# Altium schematic sheet so do mach.SchDoc
size A2
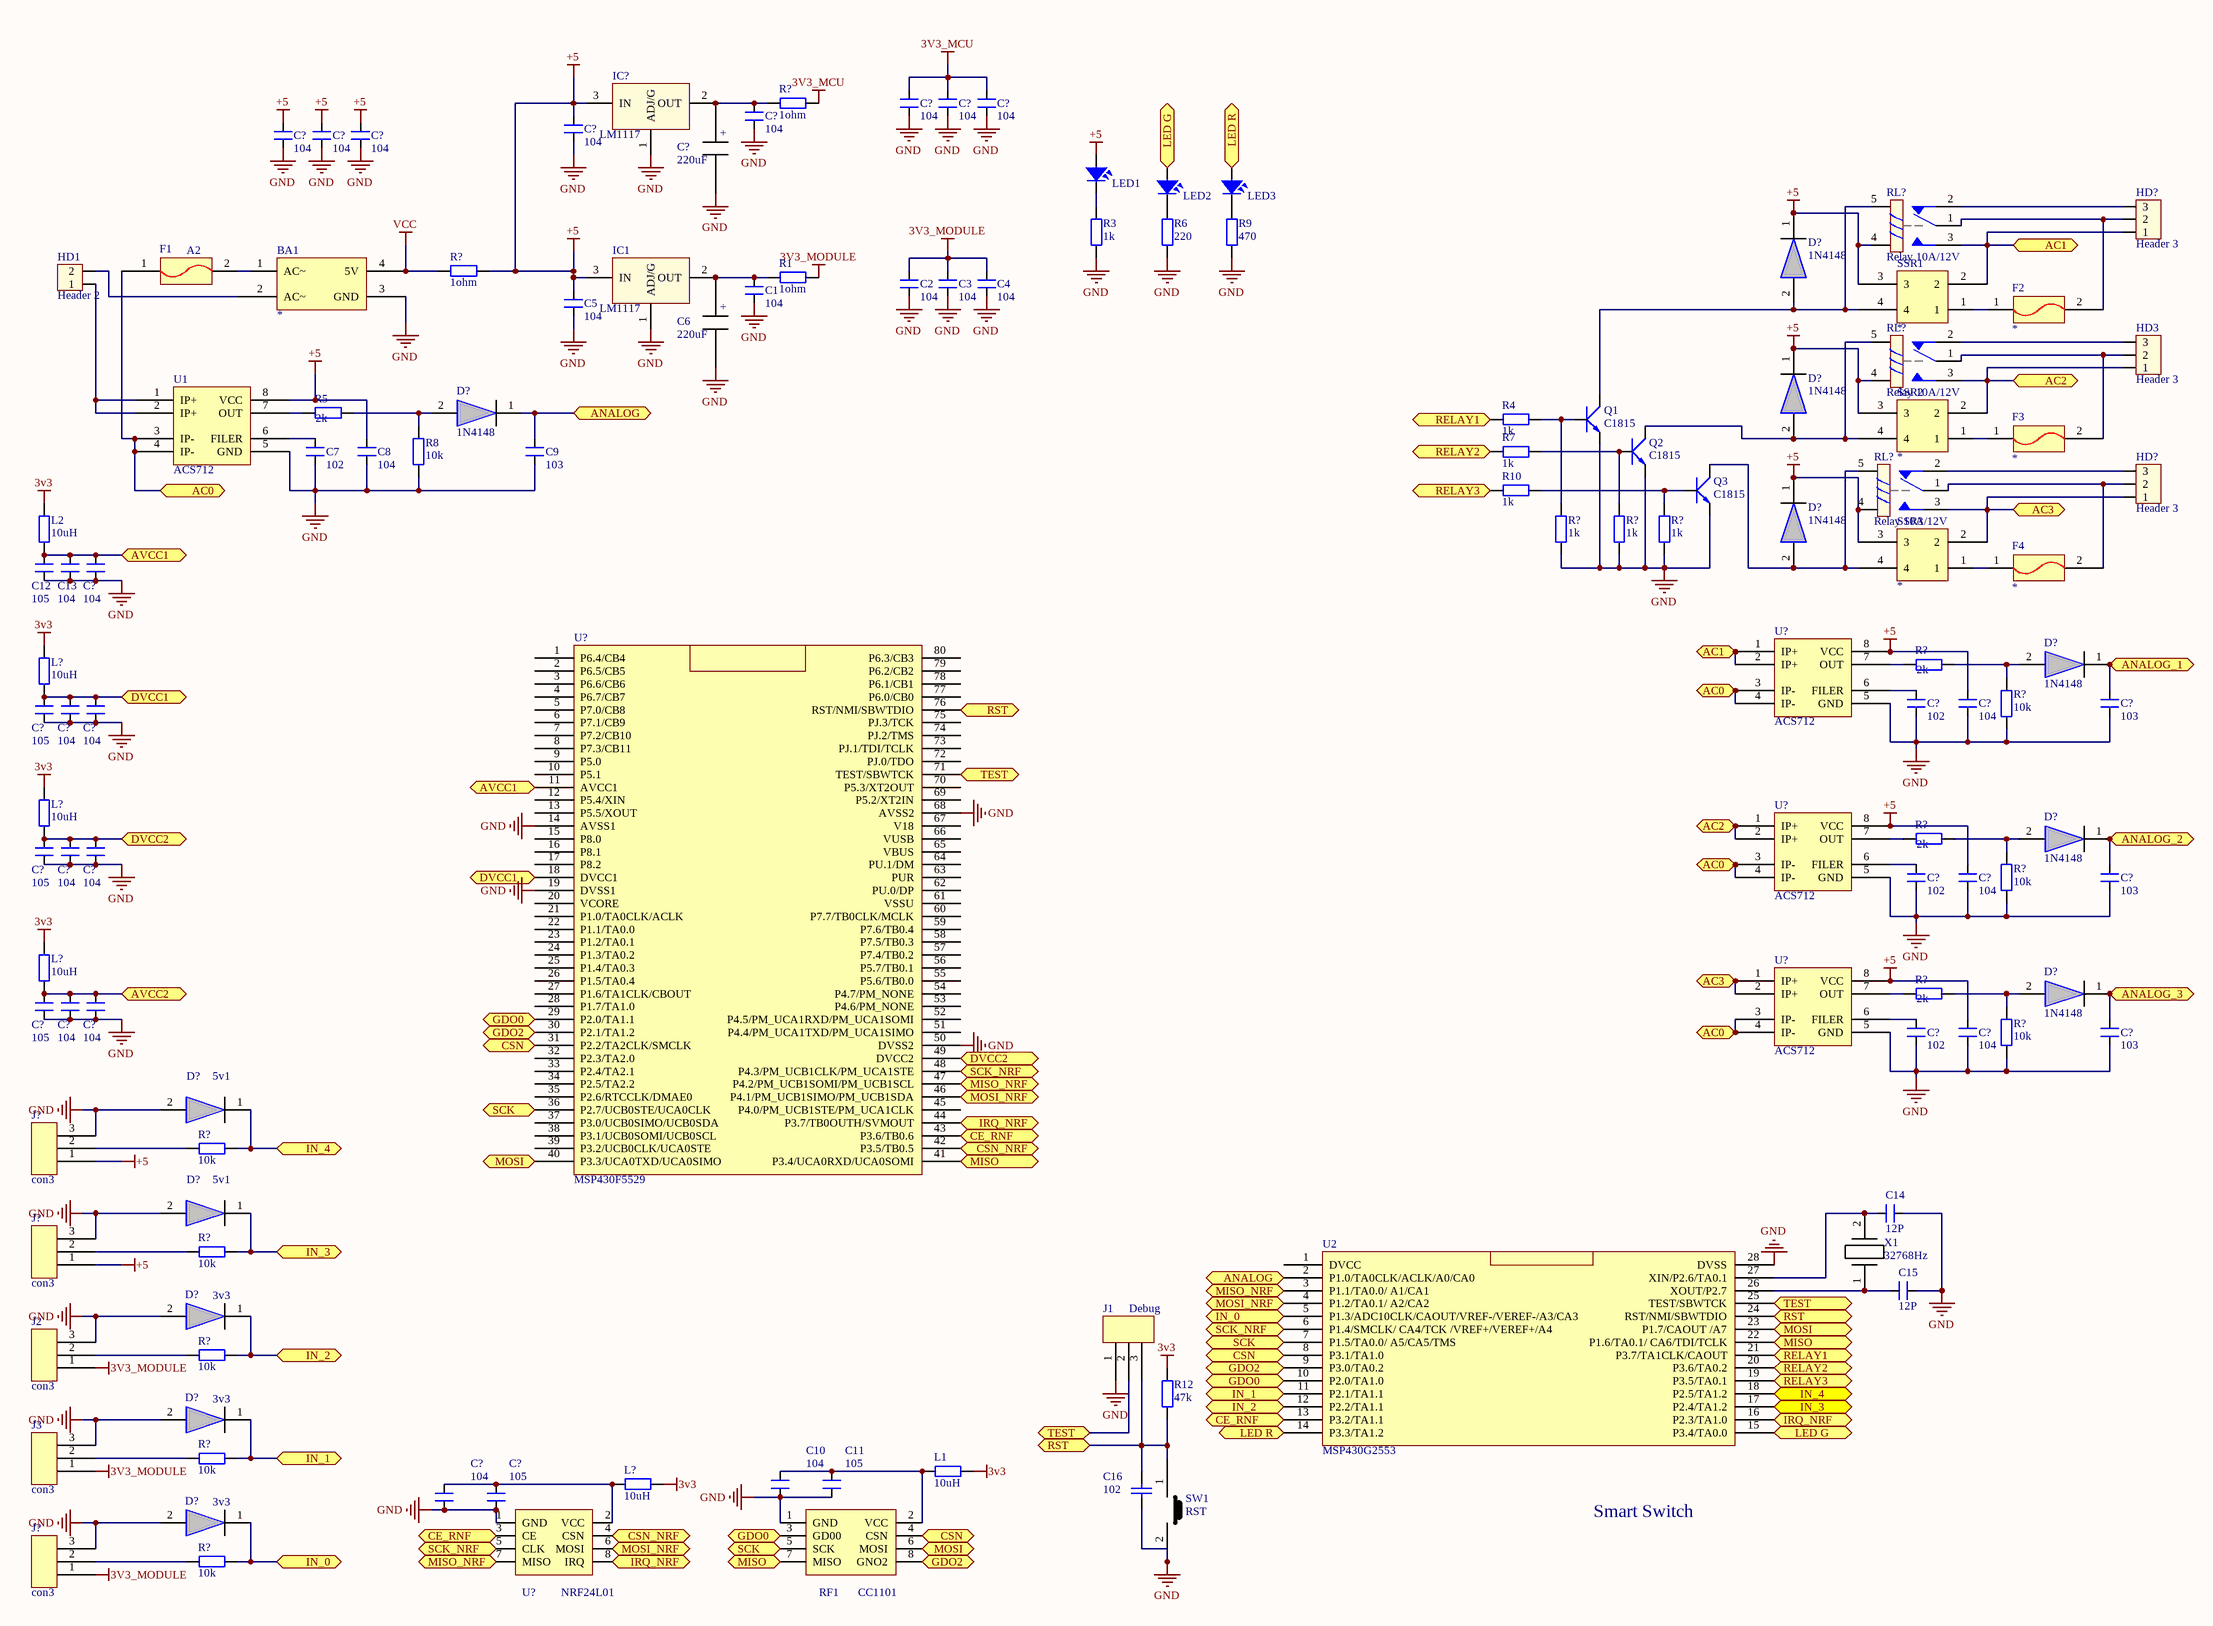
[diagram p0: so do mach.SchDoc]

## Parts
(Parts that share a designator on the sheet are numbered #1, #2 ... from top to bottom, then left to right.)
BA1  *  [bien ap 5V-700ma]
C1  104  [CM-0805]
C2  104  [CM-0805]
C3  104  [CM-0805]
C4  104  [CM-0805]
C5  104  [CM-0805]
C6  220uF  [CAPAE7053X54M]
C7  102  [CM-0805]
C8  104  [CM-0805]
C9  103  [CM-0805]
C10  104  [CM-0805]
C11  105  [CM-0805]
C12  105  [CM-0805]
C13  104  [CM-0805]
C14  12P  [CM-0805]
C15  12P  [CM-0805]
C16  value 102  [C0805]  (hidden comment: Capacitor Ceramic)
C?#1  104  [CM-0805]
C?#2  104  [CM-0805]
C?#3  104  [CM-0805]
C?#4  104  [CM-0805]
C?#5  104  [CM-0805]
C?#6  104  [CM-0805]
C?#7  104  [CM-0805]
C?#8  104  [CM-0805]
C?#9  220uF  [CAPAE7053X54M]
C?#10  104  [CM-0805]
C?#11  102  [CM-0805]
C?#12  104  [CM-0805]
C?#13  103  [CM-0805]
C?#14  105  [CM-0805]
C?#15  104  [CM-0805]
C?#16  104  [CM-0805]
C?#17  105  [CM-0805]
C?#18  104  [CM-0805]
C?#19  104  [CM-0805]
C?#20  102  [CM-0805]
C?#21  104  [CM-0805]
C?#22  103  [CM-0805]
C?#23  105  [CM-0805]
C?#24  104  [CM-0805]
C?#25  104  [CM-0805]
C?#26  102  [CM-0805]
C?#27  104  [CM-0805]
C?#28  103  [CM-0805]
C?#29  104  [CM-0805]
C?#30  105  [CM-0805]
D?#1  1N4148  [DIOMELF3615N]
D?#2  1N4148  [DIOMELF3615N]
D?#3  1N4148  [DIOMELF3615N]
D?#4  1N4148  [DIOMELF3615N]
D?#5  1N4148  [DIOMELF3615N]
D?#6  1N4148  [DIOMELF3615N]
D?#7  1N4148  [DIOMELF3615N]
D?#8  5v1  [DIOMELF3615N]
D?#9  5v1  [DIOMELF3615N]
D?#10  3v3  [DIOMELF3615N]
D?#11  3v3  [DIOMELF3615N]
D?#12  3v3  [DIOMELF3615N]
F1  A2  [Fuse 2A - duplicate]
F2  *  [Fuse 2A - duplicate]
F3  *  [Fuse 2A - duplicate]
F4  *  [Fuse 2A - duplicate]
HD1  Header 2  [HED2]
HD3  Header 3  [HED3]
HD?#1  Header 3  [HED3]
HD?#2  Header 3  [HED3]
IC1  LM1117  [SOT223-4N]
IC?  LM1117  [SOT223-4N]
J1  Debug  [Con3]
J2  con3  [Con3]
J3  con3  [Con3]
J?#1  con3  [Con3]
J?#2  con3  [Con3]
J?#3  con3  [Con3]
L1  10uH  [SM-RES-0805]
L2  10uH  [SM-RES-0805]
L?#1  10uH  [SM-RES-0805]
L?#2  10uH  [SM-RES-0805]
L?#3  10uH  [SM-RES-0805]
L?#4  10uH  [SM-RES-0805]
LED1  LED  [LED-3]  (value not drawn)
LED2  LED  [LED-3]  (value not drawn)
LED3  LED  [LED-3]  (value not drawn)
Q1  C1815  [SOT23B]
Q2  C1815  [SOT23B]
Q3  C1815  [SOT23B]
R1  1ohm  [SM-RES-0805]
R3  1k  [SM-RES-0805]
R4  1k  [SM-RES-0805]
R5  2k  [SM-RES-0805]
R6  220  [SM-RES-0805]
R7  1k  [SM-RES-0805]
R8  10k  [SM-RES-0805]
R9  470  [SM-RES-0805]
R10  1k  [SM-RES-0805]
R12  47k  [SM-RES-0805]
R?#1  1ohm  [SM-RES-0805]
R?#2  1ohm  [SM-RES-0805]
R?#3  1k  [SM-RES-0805]
R?#4  1k  [SM-RES-0805]
R?#5  1k  [SM-RES-0805]
R?#6  2k  [SM-RES-0805]
R?#7  10k  [SM-RES-0805]
R?#8  2k  [SM-RES-0805]
R?#9  10k  [SM-RES-0805]
R?#10  2k  [SM-RES-0805]
R?#11  10k  [SM-RES-0805]
R?#12  10k  [SM-RES-0805]
R?#13  10k  [SM-RES-0805]
R?#14  10k  [SM-RES-0805]
R?#15  10k  [SM-RES-0805]
R?#16  10k  [SM-RES-0805]
RF1  CC1101  [CC1101 - duplicate1]
RL?#1  Relay 10A/12V  [RL_SPDT_10A]
RL?#2  Relay 10A/12V  [RL_SPDT_10A]
RL?#3  Relay 10A/12V  [RL_SPDT_10A]
SSR1  *  [OMRON g3mb]
SSR2  *  [OMRON g3mb]
SSR3  *  [OMRON g3mb]
SW1  RST  [BUTTON]
U1  ACS712  [SOIC127P600X265-8N]
U2  MSP430G2553  [TSOP65P640X120-28N]
U?#1  ACS712  [SOIC127P600X265-8N]
U?#2  ACS712  [SOIC127P600X265-8N]
U?#3  MSP430F5529  [SQFP50P1400X1400X245-80N]
U?#4  ACS712  [SOIC127P600X265-8N]
U?#5  NRF24L01  [NRF24L01]
X1  32768Hz  [32768hz]

## Ports
AC0, AC1, AC2, AC3, ANALOG, ANALOG_1, ANALOG_2, ANALOG_3, AVCC1, AVCC2, CE_RNF, CSN, CSN_NRF, DVCC1, DVCC2, GDO0, GDO2, IN_0, IN_1, IN_2, IN_3, IN_4, IRQ_NRF, LED G, LED R, MISO, MISO_NRF, MOSI, MOSI_NRF, RELAY1, RELAY2, RELAY3, RST, SCK, SCK_NRF, TEST

## Nets
3v3: L1.2 L2.2 L?#1.2 L?#2.2 L?#3.2 L?#4.2 R12.1
3V3_MCU: C?#1.2 C?#2.2 C?#3.2 R?#1.1
3V3_MODULE: C2.2 C3.2 C4.2 J2.1 J3.1 J?#3.1 R1.1
+5: C5.2 C8.2 C?#5.2 C?#6.2 C?#7.2 C?#8.2 C?#12.2 C?#21.2 C?#27.2 D?#1.1 D?#2.1 D?#4.1 IC1.3(IN) IC?.3(IN) J?#1.1 J?#2.1 LED1.1 R?#2.1 RL?#1.4 RL?#2.4 RL?#3.4 SSR1.3 SSR2.3 SSR3.3 U1.8(VCC) U?#1.8(VCC) U?#2.8(VCC) U?#4.8(VCC)
GND: BA1.3(GND) C1.1 C2.1 C3.1 C4.1 C5.1 C6.2 C7.1 C8.1 C9.1 C10.1 C11.1 C12.1 C13.1 C14.2 C15.2 C16.1 C?#1.1 C?#2.1 C?#3.1 C?#4.1 C?#5.1 C?#6.1 C?#7.1 C?#8.1 C?#9.2 C?#10.1 C?#11.1 C?#12.1 C?#13.1 C?#14.1 C?#15.1 C?#16.1 C?#17.1 C?#18.1 C?#19.1 C?#20.1 C?#21.1 C?#22.1 C?#23.1 C?#24.1 C?#25.1 C?#26.1 C?#27.1 C?#28.1 C?#29.1 C?#30.1 D?#8.2 D?#9.2 D?#10.2 D?#11.2 D?#12.2 IC1.1(ADJ/G) IC?.1(ADJ/G) J1.1 J2.3 J3.3 J?#1.3 J?#2.3 J?#3.3 Q1.1(E) Q2.1(E) Q3.1(E) R3.1 R6.2 R8.1 R9.2 R?#3.2 R?#4.2 R?#5.2 R?#7.1 R?#9.1 R?#11.1 RF1.1(GND) SW1.2 U1.5(GND) U2.28(DVSS) U?#1.5(GND) U?#2.5(GND) U?#3.14(AVSS1) U?#3.19(DVSS1) U?#3.50(DVSS2) U?#3.68(AVSS2) U?#4.5(GND) U?#5.1(GND)
VCC: BA1.4(5V) R?#2.2
AC0: F1.1 U1.3(IP-) U1.4(IP-) U?#1.3(IP-) U?#1.4(IP-) U?#2.3(IP-) U?#2.4(IP-) U?#4.3(IP-) U?#4.4(IP-) ; port AC0
AC1: HD?#1.1 RL?#1.3 SSR1.2 U?#1.1(IP+) U?#1.2(IP+) ; port AC1
AC2: HD3.1 RL?#2.3 SSR2.2 U?#2.1(IP+) U?#2.2(IP+) ; port AC2
AC3: HD?#2.1 RL?#3.3 SSR3.2 U?#4.1(IP+) U?#4.2(IP+) ; port AC3
ANALOG: C9.2 D?#3.1 U2.2(P1.0/TA0CLK/ACLK/A0/CA0) ; port ANALOG
ANALOG_1: C?#13.2 D?#5.1 ; port ANALOG_1
ANALOG_2: C?#22.2 D?#6.1 ; port ANALOG_2
ANALOG_3: C?#28.2 D?#7.1 ; port ANALOG_3
AVCC1: C12.2 C13.2 C?#10.2 L2.1 U?#3.11(AVCC1) ; port AVCC1
AVCC2: C?#23.2 C?#24.2 C?#25.2 L?#3.1 ; port AVCC2
CE_RNF: U2.13(P3.2/TA1.1) U?#3.43(P3.6/TB0.6) U?#5.3(CE) ; port CE_RNF
CSN: RF1.4(CSN) U2.8(P3.1/TA1.0) U?#3.31(P2.2/TA2CLK/SMCLK) ; port CSN
CSN_NRF: U?#3.42(P3.5/TB0.5) U?#5.4(CSN) ; port CSN_NRF
DVCC1: C?#14.2 C?#15.2 C?#16.2 L?#1.1 U?#3.18(DVCC1) ; port DVCC1
DVCC2: C?#17.2 C?#18.2 C?#19.2 L?#2.1 U?#3.49(DVCC2) ; port DVCC2
GDO0: RF1.3(GD00) U2.10(P2.0/TA1.0) U?#3.29(P2.0/TA1.1) ; port GDO0
GDO2: RF1.8(GNO2) U2.9(P3.0/TA0.2) U?#3.30(P2.1/TA1.2) ; port GDO2
IN_0: D?#12.1 R?#16.1 U2.5(P1.3/ADC10CLK/CAOUT/VREF-/VEREF-/A3/CA3) ; port IN_0
IN_1: D?#11.1 R?#15.1 U2.11(P2.1/TA1.1) ; port IN_1
IN_2: D?#10.1 R?#14.1 U2.12(P2.2/TA1.1) ; port IN_2
IN_3: D?#9.1 R?#13.1 U2.17(P2.4/TA1.2) ; port IN_3
IN_4: D?#8.1 R?#12.1 U2.18(P2.5/TA1.2) ; port IN_4
IRQ_NRF: U2.16(P2.3/TA1.0) U?#3.44(P3.7/TB0OUTH/SVMOUT) U?#5.8(IRQ) ; port IRQ_NRF
LED G: LED2.1 U2.15(P3.4/TA0.0) ; port LED G
LED R: LED3.1 U2.14(P3.3/TA1.2) ; port LED R
MISO: RF1.7(MISO) U2.22(P1.6/TA0.1/_CA6/TDI/TCLK) U?#3.41(P3.4/UCA0RXD/UCA0SOMI) ; port MISO
MISO_NRF: U2.3(P1.1/TA0.0/_A1/CA1) U?#3.47(P4.2/PM_UCB1SOMI/PM_UCB1SCL) U?#5.7(MISO) ; port MISO_NRF
MOSI: RF1.6(MOSI) U2.23(P1.7/CAOUT_/A7) U?#3.40(P3.3/UCA0TXD/UCA0SIMO) ; port MOSI
MOSI_NRF: U2.4(P1.2/TA0.1/_A2/CA2) U?#3.46(P4.1/PM_UCB1SIMO/PM_UCB1SDA) U?#5.6(MOSI) ; port MOSI_NRF
RELAY1: R4.2 U2.21(P3.7/TA1CLK/CAOUT) ; port RELAY1
RELAY2: R7.2 U2.20(P3.6/TA0.2) ; port RELAY2
RELAY3: R10.2 U2.19(P3.5/TA0.1) ; port RELAY3
RST: C16.2 J1.3 R12.2 SW1.1 U2.24(RST/NMI/SBWTDIO) U?#3.76(RST/NMI/SBWTDIO) ; port RST
SCK: RF1.5(SCK) U2.7(P1.5/TA0.0/_A5/CA5/TMS) U?#3.36(P2.7/UCB0STE/UCA0CLK) ; port SCK
SCK_NRF: U2.6(P1.4/SMCLK/_CA4/TCK_/VREF+/VEREF+/A4) U?#3.48(P4.3/PM_UCB1CLK/PM_UCA1STE) U?#5.5(CLK) ; port SCK_NRF
TEST: J1.2 U2.25(TEST/SBWTCK) U?#3.71(TEST/SBWTCK) ; port TEST
NetBA1_1: BA1.1(AC~) F1.2
NetBA1_2: BA1.2(AC~) HD1.2
NetC1_2: C1.2 C6.1 IC1.2(OUT) R1.2
NetC7_2: C7.2 U1.6(FILER)
NetC10_2: C10.2 C11.2 L1.1 RF1.2(VCC)
NetC14_1: C14.1 U2.27(XIN/P2.6/TA0.1) X1.2
NetC15_1: C15.1 U2.26(XOUT/P2.7) X1.1
NetC?#4_2: C?#4.2 C?#9.1 IC?.2(OUT) R?#1.2
NetC?#11_2: C?#11.2 U?#1.6(FILER)
NetC?#20_2: C?#20.2 U?#2.6(FILER)
NetC?#26_2: C?#26.2 U?#4.6(FILER)
NetC?#29_2: C?#29.2 C?#30.2 L?#4.1 U?#5.2(VCC)
NetD?#1_2: D?#1.2 Q1.2(C) RL?#1.5 SSR1.4
NetD?#2_2: D?#2.2 Q2.2(C) RL?#2.5 SSR2.4
NetD?#3_2: D?#3.2 R5.2 R8.2
NetD?#4_2: D?#4.2 Q3.2(C) RL?#3.5 SSR3.4
NetD?#5_2: D?#5.2 R?#6.2 R?#7.2
NetD?#6_2: D?#6.2 R?#8.2 R?#9.2
NetD?#7_2: D?#7.2 R?#10.2 R?#11.2
NetF2_1: F2.1 SSR1.1
NetF2_2: F2.2 HD?#1.2 RL?#1.1
NetF3_1: F3.1 SSR2.1
NetF3_2: F3.2 HD3.2 RL?#2.1
NetF4_1: F4.1 SSR3.1
NetF4_2: F4.2 HD?#2.2 RL?#3.1
NetHD1_1: HD1.1 U1.1(IP+) U1.2(IP+)
NetHD3_3: HD3.3 RL?#2.2
NetHD?#1_3: HD?#1.3 RL?#1.2
NetHD?#2_3: HD?#2.3 RL?#3.2
NetJ2_2: J2.2 R?#14.2
NetJ3_2: J3.2 R?#15.2
NetJ?#1_2: J?#1.2 R?#12.2
NetJ?#2_2: J?#2.2 R?#13.2
NetJ?#3_2: J?#3.2 R?#16.2
NetLED1_2: LED1.2 R3.2
NetLED2_2: LED2.2 R6.1
NetLED3_2: LED3.2 R9.1
NetQ1_3: Q1.3(B) R4.1 R?#3.1
NetQ2_3: Q2.3(B) R7.1 R?#4.1
NetQ3_3: Q3.3(B) R10.1 R?#5.1
NetR5_1: R5.1 U1.7(OUT)
NetR?#6_1: R?#6.1 U?#1.7(OUT)
NetR?#8_1: R?#8.1 U?#2.7(OUT)
NetR?#10_1: R?#10.1 U?#4.7(OUT)

Not connected (* = marked no-connect by the designer): U2 1(DVCC); U?#3 1(P6.4/CB4) 2(P6.5/CB5) 3(P6.6/CB6) 4(P6.7/CB7) 5(P7.0/CB8) 6(P7.1/CB9) 7(P7.2/CB10) 8(P7.3/CB11) 9(P5.0) 10(P5.1) 12(P5.4/XIN) 13(P5.5/XOUT) 15(P8.0) 16(P8.1) 17(P8.2) 20(VCORE) 21(P1.0/TA0CLK/ACLK) 22(P1.1/TA0.0) 23(P1.2/TA0.1) 24(P1.3/TA0.2) 25(P1.4/TA0.3) 26(P1.5/TA0.4) 27(P1.6/TA1CLK/CBOUT) 28(P1.7/TA1.0) 32(P2.3/TA2.0) 33(P2.4/TA2.1) 34(P2.5/TA2.2) 35(P2.6/RTCCLK/DMAE0) 37(P3.0/UCB0SIMO/UCB0SDA) 38(P3.1/UCB0SOMI/UCB0SCL) 39(P3.2/UCB0CLK/UCA0STE) 45(P4.0/PM_UCB1STE/PM_UCA1CLK) 51(P4.4/PM_UCA1TXD/PM_UCA1SIMO) 52(P4.5/PM_UCA1RXD/PM_UCA1SOMI) 53(P4.6/PM_NONE) 54(P4.7/PM_NONE) 55(P5.6/TB0.0) 56(P5.7/TB0.1) 57(P7.4/TB0.2) 58(P7.5/TB0.3) 59(P7.6/TB0.4) 60(P7.7/TB0CLK/MCLK) 61(VSSU) 62(PU.0/DP) 63(PUR) 64(PU.1/DM) 65(VBUS) 66(VUSB) 67(V18) 69(P5.2/XT2IN) 70(P5.3/XT2OUT) 72(PJ.0/TDO) 73(PJ.1/TDI/TCLK) 74(PJ.2/TMS) 75(PJ.3/TCK) 77(P6.0/CB0) 78(P6.1/CB1) 79(P6.2/CB2) 80(P6.3/CB3)

## Notes on the sheet
- Smart Switch
- (in symbol Component_1) +

## Library data of the parts
BA1 C6 C?#9 D?#1-D?#12 F1-F4 SSR1-SSR3 SW1 U2 = Component_1
C1-C5 C7 C8 C10-C15 C?#1-C?#8 C?#10-C?#12 C?#14-C?#21 C?#23-C?#27 C?#29 C?#30 = CM: Cap SMD; Value: 103
C9 C?#13 C?#22 C?#28 = CM: Cap SMD; Value: 103
C16 = CapSMD: Capacitor; Published: 8-Jun-2000; LatestRevisionDate: 17-Jul-2002; LatestRevisionNote: Re-released for DXP Platform.; PackageReference: RAD-0.3; Publisher: Altium Limited
HD1 = Hed2: Header 2 (Green); Value: Header 2
HD3 HD?#1 HD?#2 = Hed3: Header 3 (Green); Value: Header 3
IC1 IC? = LM1117: Available in 1.8V, 2.5V, 2.85V, 3.3V, 5V, and  Adjustable Versions; Value: LM317
J1 = con3
L1 L2 L?#1-L?#4 R1 R3-R10 R12 R?#1-R?#16 = R1/4W: Resistor 1/4W; Value: R1/4W - 1K
LED1-LED3 = LED: LED Single colour Green and Red; Value: LED 3 ly Single Colour
Q1-Q3 = C1815: NPN 600mW, ECB; Value: C1815
RL?#1-RL?#3 = Relay 1: Relay SPDT,10A - 12VDC 5 Pin; Value: Relay SPDT, 10A, 12V
U?#5 = Module NRF24L01+